# EAGLE design tas5753 (EAGLE 6.6.0)
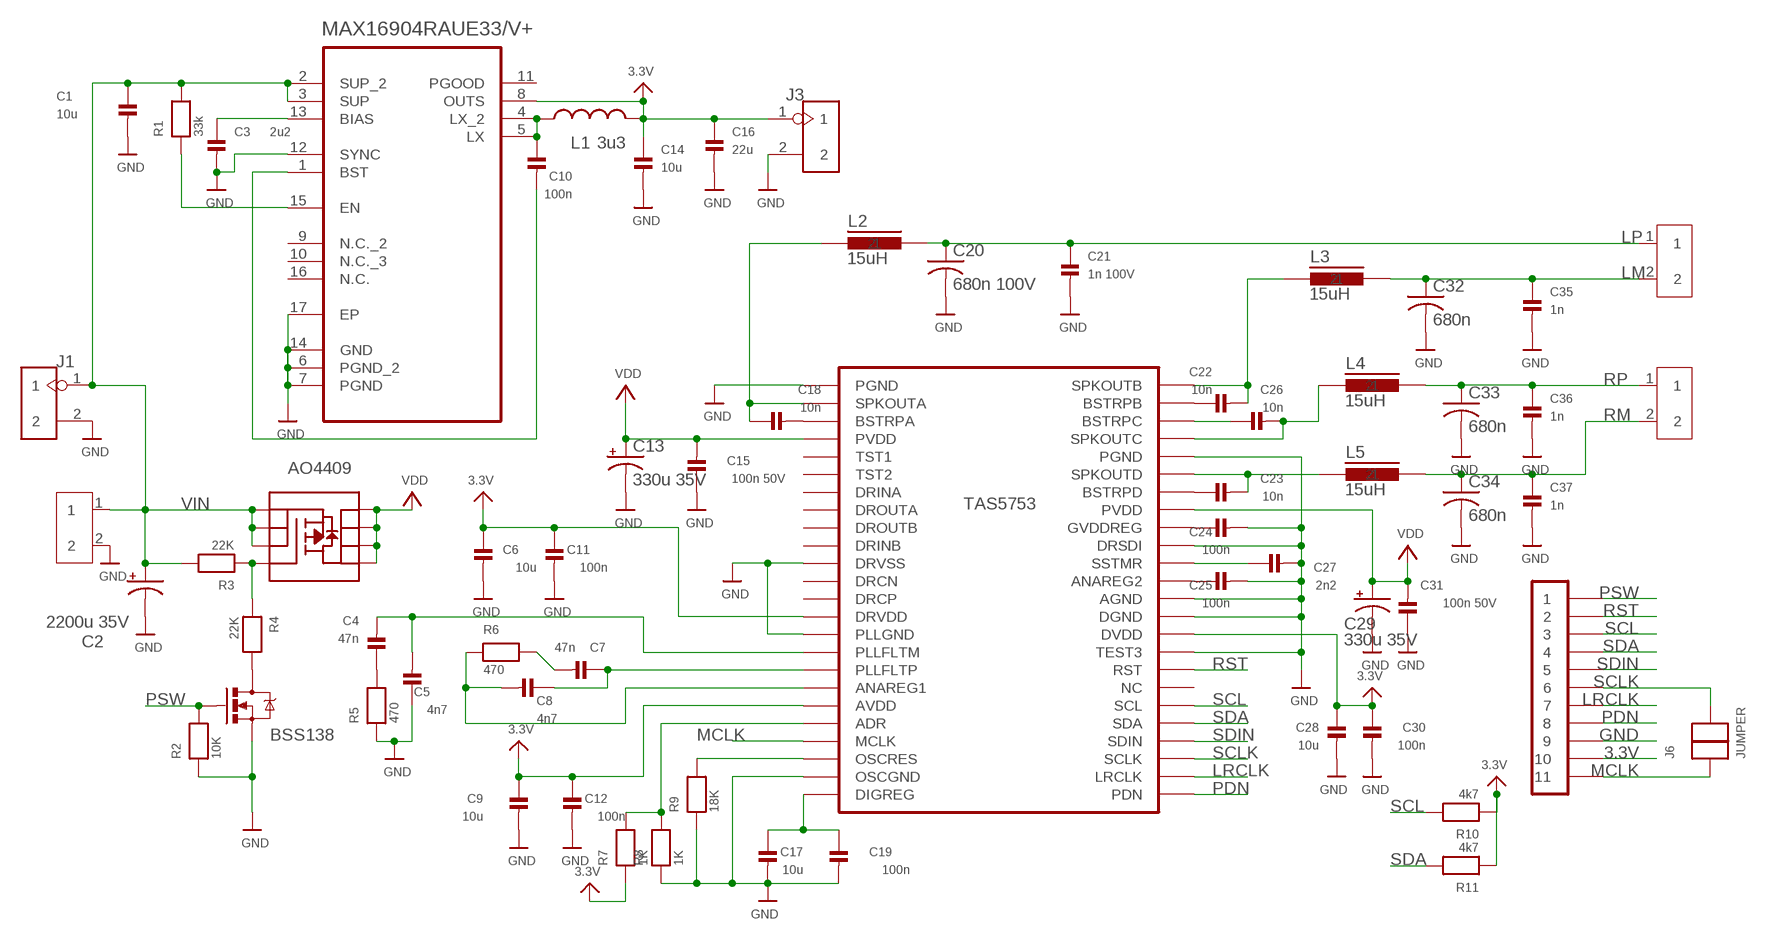
[diagram p0: schematic, sheet 1]

## Parts
C1  10u  CAP_CERAMIC0805  [0805]
C2  2200u 35V  CAP_POLPTH4  [CPOL-RADIAL-1000UF-25V]
C3  2u2  CAP_CERAMIC0805  [0805]
C4  47n  CAP_CERAMIC0603  [0603]
C5  4n7  CAP_CERAMIC0603  [0603]
C6  10u  CAP_CERAMIC0603  [0603]
C7  47n  CAP_CERAMIC0603  [0603]
C8  4n7  CAP_CERAMIC0603  [0603]
C9  10u  CAP_CERAMIC0603  [0603]
C10  100n  CAP_CERAMIC0603  [0603]
C11  100n  CAP_CERAMIC0603  [0603]
C12  100n  CAP_CERAMIC0603  [0603]
C13  330u 35V  CAP_POLE  [PANASONIC_E]
C14  10u  CAP_CERAMIC0805  [0805]
C15  100n 50V  CAP_CERAMIC0603  [0603]
C16  22u  CAP_CERAMIC1206  [1206]
C17  10u  CAP_CERAMIC0603  [0603]
C18  10n  CAP_CERAMIC0603  [0603]
C19  100n  CAP_CERAMIC0603  [0603]
C20  680n 100V  C-US050-045X075  [C050-045X075]
C21  1n 100V  CAP_CERAMIC1206  [1206]
C22  10n  CAP_CERAMIC0603  [0603]
C23  10n  CAP_CERAMIC0603  [0603]
C24  100n  CAP_CERAMIC0603  [0603]
C25  100n  CAP_CERAMIC0603  [0603]
C26  10n  CAP_CERAMIC0603  [0603]
C27  2n2  CAP_CERAMIC0603  [0603]
C28  10u  CAP_CERAMIC0603  [0603]
C29  330u 35V  CAP_POLE  [PANASONIC_E]
C30  100n  CAP_CERAMIC0603  [0603]
C31  100n 50V  CAP_CERAMIC0603  [0603]
C32  680n  C-US050-045X075  [C050-045X075]
C33  680n  C-US050-045X075  [C050-045X075]
C34  680n  C-US050-045X075  [C050-045X075]
C35  1n  CAP_CERAMIC1206  [1206]
C36  1n  CAP_CERAMIC1206  [1206]
C37  1n  CAP_CERAMIC1206  [1206]
IC1  AO4409  MOSFET-PCHANNEL-SOIC8SOIC8  [SO08]
J1  HEADER-2P-2.0  [2P-2.0]
J2  SCREW-TERMINAL-2P'5.08'  [2P-5.08]
J3  HEADER-2P-2.0  [2P-2.0]
J4  SCREW-TERMINAL-2P'5.08'  [2P-5.08]
J5  SCREW-TERMINAL-2P'5.08'  [2P-5.08]
J6  JUMPER  [JUMPER]
L1  3u3  INDUCTORCR54  [CR54]
L2  15uH  DR125  [DR125]
L3  15uH  DR125  [DR125]
L4  15uH  DR125  [DR125]
L5  15uH  DR125  [DR125]
P1  CONN_1X11_SMT_254  [CONN_SMT_1X11_254]
Q1  BSS138  MOSFET-NCHANNELBSS138  [SOT23]
R1  33k  RESISTOR0603  [0603]
R2  10K  RESISTOR0603  [0603]
R3  22K  RESISTOR0603  [0603]
R4  22K  RESISTOR0603  [0603]
R5  470  RESISTOR0603  [0603]
R6  470  RESISTOR0603  [0603]
R7  1K  RESISTOR0603  [0603]
R8  1K  RESISTOR0603  [0603]
R9  18K  RESISTOR0603  [0603]
R10  4k7  RESISTOR0603  [0603]
R11  4k7  RESISTOR0603  [0603]
U1  MAX16904RAUE33/V+  [SOP65P638X110-17N]
U2  TAS5753  [HTSSOP_48]

## Nets
3.3V: C6.1 C9.1 C11.1 C12.1 C14.1 C16.1 C28.1 C30.1 J3.1 L1.P$2 P1.P$10 R7.1 R10.1 R11.1 U1.8(OUTS) U2.P$14(DRVDD) U2.P$19(AVDD) U2.P$34(DVDD)
GND: C1.2 C2.2(-) C3.2 C5.1 C6.2 C9.2 C11.2 C12.2 C13.- C14.2 C15.1 C16.2 C17.2 C19.2 C20.2 C21.2 C24.2 C25.2 C27.2 C28.2 C29.- C30.2 C31.1 C32.2 C33.2 C34.2 C35.2 C36.2 C37.2 J1.2 J2.2 J3.2 P1.P$9 Q1.2(S) R2.1 R5.1 R8.1 R9.1 U1.6(PGND_2) U1.7(PGND) U1.12(SYNC) U1.14(GND) U1.17(EP) U2.P$1(PGND) U2.P$11(DRVSS) U2.P$15(PLLGND) U2.P$23(OSCGND) U2.P$33(TEST3) U2.P$35(DGND) U2.P$36(AGND) U2.P$39(DRSDI) U2.P$44(PGND) U2.P$49(PGND)
LM: C32.1 C35.1 J4.2 L3.2
LP: C20.1 C21.1 J4.1 L2.2
LRCLK: P1.P$7 U2.P$26(LRCLK)
MCLK: J6.1 P1.P$11 U2.P$21(MCLK)
N$1: R9.2 U2.P$22(OSCRES)
N$2: C7.2 R6.2
N$3: C18.2 U2.P$3(BSTRPA)
N$4: C7.1 C8.1 U2.P$17(PLLFLTP)
N$5: C26.1 U2.P$46(BSTRPC)
N$6: C22.1 U2.P$47(BSTRPB)
N$7: C22.2 L3.1 U2.P$48(SPKOUTB)
N$8: C26.2 L4.1 U2.P$45(SPKOUTC)
N$9: R7.2 R8.2 U2.P$20(ADR)
N$10: C4.1 R5.2
N$11: C18.1 L2.1 U2.P$2(SPKOUTA)
N$12: C4.2 C5.2 U2.P$16(PLLFLTM)
N$13: C23.1 U2.P$42(BSTRPD)
N$14: C23.2 L5.1 U2.P$43(SPKOUTD)
N$15: C27.1 U2.P$38(SSTMR)
N$16: C25.1 U2.P$37(ANAREG2)
N$17: IC1.4(G) R3.1 R4.1
N$18: C24.1 U2.P$40(GVDDREG)
N$20: C10.1 L1.P$1 U1.4(LX_2) U1.5(LX)
N$22: C10.2 U1.1(BST)
N$23: C8.2 R6.1 U2.P$18(ANAREG1)
N$24: C3.1 U1.13(BIAS)
N$25: R1.1 U1.15(EN)
N$27: C17.1 C19.1 U2.P$24(DIGREG)
N$28: Q1.3(D) R4.2
PDN: P1.P$8 U2.P$25(PDN)
PSW: P1.P$1 Q1.1(G) R2.2
RM: C34.1 C37.1 J5.2 L5.2
RP: C33.1 C36.1 J5.1 L4.2
RST: P1.P$2 U2.P$32(RST)
SCL: P1.P$3 R10.2 U2.P$30(SCL)
SCLK: J6.2 P1.P$6 U2.P$27(SCLK)
SDA: P1.P$4 R11.2 U2.P$29(SDA)
SDIN: P1.P$5 U2.P$28(SDIN)
VDD: C13.+ C15.2 C29.+ C31.2 IC1.5(D) IC1.6(D) IC1.7(D) IC1.8(D) U2.P$4(PVDD) U2.P$41(PVDD)
VIN: C1.1 C2.1(+) IC1.1(S) IC1.2(S) IC1.3(S) J1.1 J2.1 R1.2 R3.2 U1.2(SUP_2) U1.3(SUP)
Unconnected: U1.9(N.C._2) U1.10(N.C._3) U1.11(PGOOD) U1.16(N.C.) U2.P$5(TST1) U2.P$6(TST2) U2.P$7(DRINA) U2.P$8(DROUTA) U2.P$9(DROUTB) U2.P$10(DRINB) U2.P$12(DRCN) U2.P$13(DRCP) U2.P$31(NC)

## Library data of the parts
C1 C3-C12 C14-C19 C21-C28 C30 C31 C35-C37 = hari:CAP_CERAMIC: Ceramic Capacitors 0402 - 0402 Surface Mount Capacitors 0.1uF 10V 10% [Digikey: 490-1318-2-ND] 0603 - 0603 Surface Mount Capacitors 16 pF 50V 5% [Digikey: 445-5051-2-ND] 22 pF 50V [Digikey: PCC220ACVTR-ND] 33 pF 50V 5% [Digikey: 490-1415-1-ND] 56pF 50V 5% [Digikey: 490-1421-1-ND] 220pF 50V 5% [Digikey: 445-1285-1-ND] 680 pF 50V 2200 pF 50V 5% C0G [Digikey: 445-1297-1-ND] 5600 pF 100V 5% X7R [Digikey: 478-3711-1-ND] 0.1 µF 25V 10% [Digikey: PCC2277TR-ND] 0.22 µF 16V 10% X7R [Digikey: 445-1318-1-ND] 1.0 µF 25V 10% [Digikey: 445-5146-2-ND] 0603 - RF Specific 3pF 250V +/-0.1pF RF [Digikey: 712-1347-1-ND] 18 pF 250V 5% [Digikey: 478-3505-1-ND or 712-1322-1-ND] 56 pF 250V 5% C0G RF [Digikey: 490-4867-1-ND] 68 pF 250V RF [Digikey: 490-4868-1-ND] 0805 - 0805 Surface Mount Capacitors 220 pF 250V 2% RF Ceramic Capacitor [Digikey: 712-1398-1-ND] 1000 pF 50V 2% NP0 Ceramic Capacitor [Digikey: 478-3760-1-ND] 0.1 µF 25V 10% Ceramic Capacitor [Digikey: PCC1828TR-ND] 1.0 µF 16V 10% Ceramic Capacitor[Digikey: 490-1691-2-ND] 10.0 µF 10V 10% Ceramic Capacitor[Digikey: 709-1228-1-ND] 1206 - 1206 Surface Mount Capacitors
C2 C13 C29 = SparkFun-Passives:CAP_POL: Capacitor Polarized These are standard SMD and PTH capacitors. Normally 10uF, 47uF, and 100uF in electrolytic and tantalum varieties. Always verify the external diameter of the through hole cap, it varies with capacity, voltage, and manufacturer. The EIA devices should be standard.
C20 C32-C34 = adafruit:C-US: CAPACITOR, American symbol
IC1 = SparkFun-DiscreteSemi:MOSFET-PCHANNEL-SOIC8: Generic 8-pin PMOSFET
J1 J3 = Connector :HEADER-2P
J2 J4 J5 = Connector :SCREW-TERMINAL-2P
J6 = hari:JUMPER
L1 = SparkFun-Passives:INDUCTOR: Inductors Basic Inductor/Choke - 0603 and 1206. Footprints are not proven and vary greatly between part numbers. SRN6045- 33uH, 20% 1.4A SDR0403-560KL - 56uH, 10%, 500mA RMS/740mA peak
L2-L5 = inductors:DR125: High Power Density, High Efficiency, Shielded Inductors Source: coiltronics_dr_series.pdf
P1 = hari:CONN_1X11_SMT_254
Q1 = SparkFun-DiscreteSemi:MOSFET-NCHANNEL: Common NMOSFET Parts MFG P/N Store ID Prod ID FDD8780 TRANS-09984 SI7820DN TRANS-11055 FDS6630A IC-08089 2N7002PW TRANS-11151 FQP30N06L COM-10213 TRANS-10060 BSS123LT1G TRANS-08345 BSS138 TRANS-00830 BS170 2N7000; PROD_ID: TRANS-00830
R1-R11 = hari:RESISTOR: Resistors 0402 - 0402 Surface Mount Package 10.0K 1% 1/16W [Digikey: 311-10.0KLRTR-ND] 0603 - 0603 Surface Mount Package 0 Ohm 1/10 Watt 1% Resistor 15 Ohm 1/10 Watt 1% Resistor 33 Ohm 1/10 Watt 1% Resistor 49.9 Ohm 1/10 Watt 1% Resistor 100 Ohm 1/10 Watt 1% Resistor 150 Ohm 1/10 Watt 1% Resistor 240 Ohm 1/10 Watt 1% Resistor 390 Ohm 1/10 Watt 1% Resistor 560 Ohm 1/10 Watt 1% Resistor 750 Ohm 1/10 Watt 1% Resistor 1.0K Ohm 1/10 Watt 1% Resistor 1.5K Ohm 1/10 Watt 1% Resistor 2.0K Ohm 1/10 Watt 1% Resistor 4.7K Ohm 1/10 Watt 1% Resistor 10.0K Ohm 1/10 Watt 1% Resistor 20.0K Ohm 1/10 Watt 1% Resistor 33.0K Ohm 1/10 Watt 1% Resistor 100.0K Ohm 1/10 Watt 1% Resistor 0805 - 0805 Surface Mount Package 0 Ohm 1/8 Watt 1% Resistor 33 Ohm 1/8 Watt 1% Resistor 100 Ohm 1/8 Watt 1% Resistor 150 Ohm 1/8 Watt 1% Resistor 200 Ohm 1/8 Watt 1% Resistor 240 Ohm 1/8 Watt 1% Resistor 330 Ohm 1/8 Watt 1% Resistor 390 Ohm 1/8 Watt 1% Resistor 470 Ohm 1/8 Watt 1% Resistor 1.0K Ohm 1/8 Watt 1% Resistor 1.5K Ohm 1/8 Watt 1% Resistor 2.0K Ohm 1/8 Watt 1% Resistor 4.7K Ohm 1/8 Watt 1% Resistor 5.1K Ohm 1/8 Watt 1% Resistor 5.6K Ohm 1/8 Watt 1% Resistor 10.0K Ohm 1/8 Watt 1% Resistor 22.0K Ohm 1/8 Watt 1% Resistor 33.0K Ohm 1/8 Watt 1% Resistor 100K Ohm 1/8 Watt 1% Resistor 1206 - 1206 Surface Mount Package
U1 = Maxim_By_element14_Batch_1:MAX16904RAUE33/V+: 2.1MHz, High-Voltage, 600mA Mini-Buck Converter; MPN: MAX16904RAUE33/V+; OC_FARNELL: -; OC_NEWARK: 71R9172; PACKAGE: TSSOP-16; SUPPLIER: Maxim
U2 = hari:TAS5753

## Board
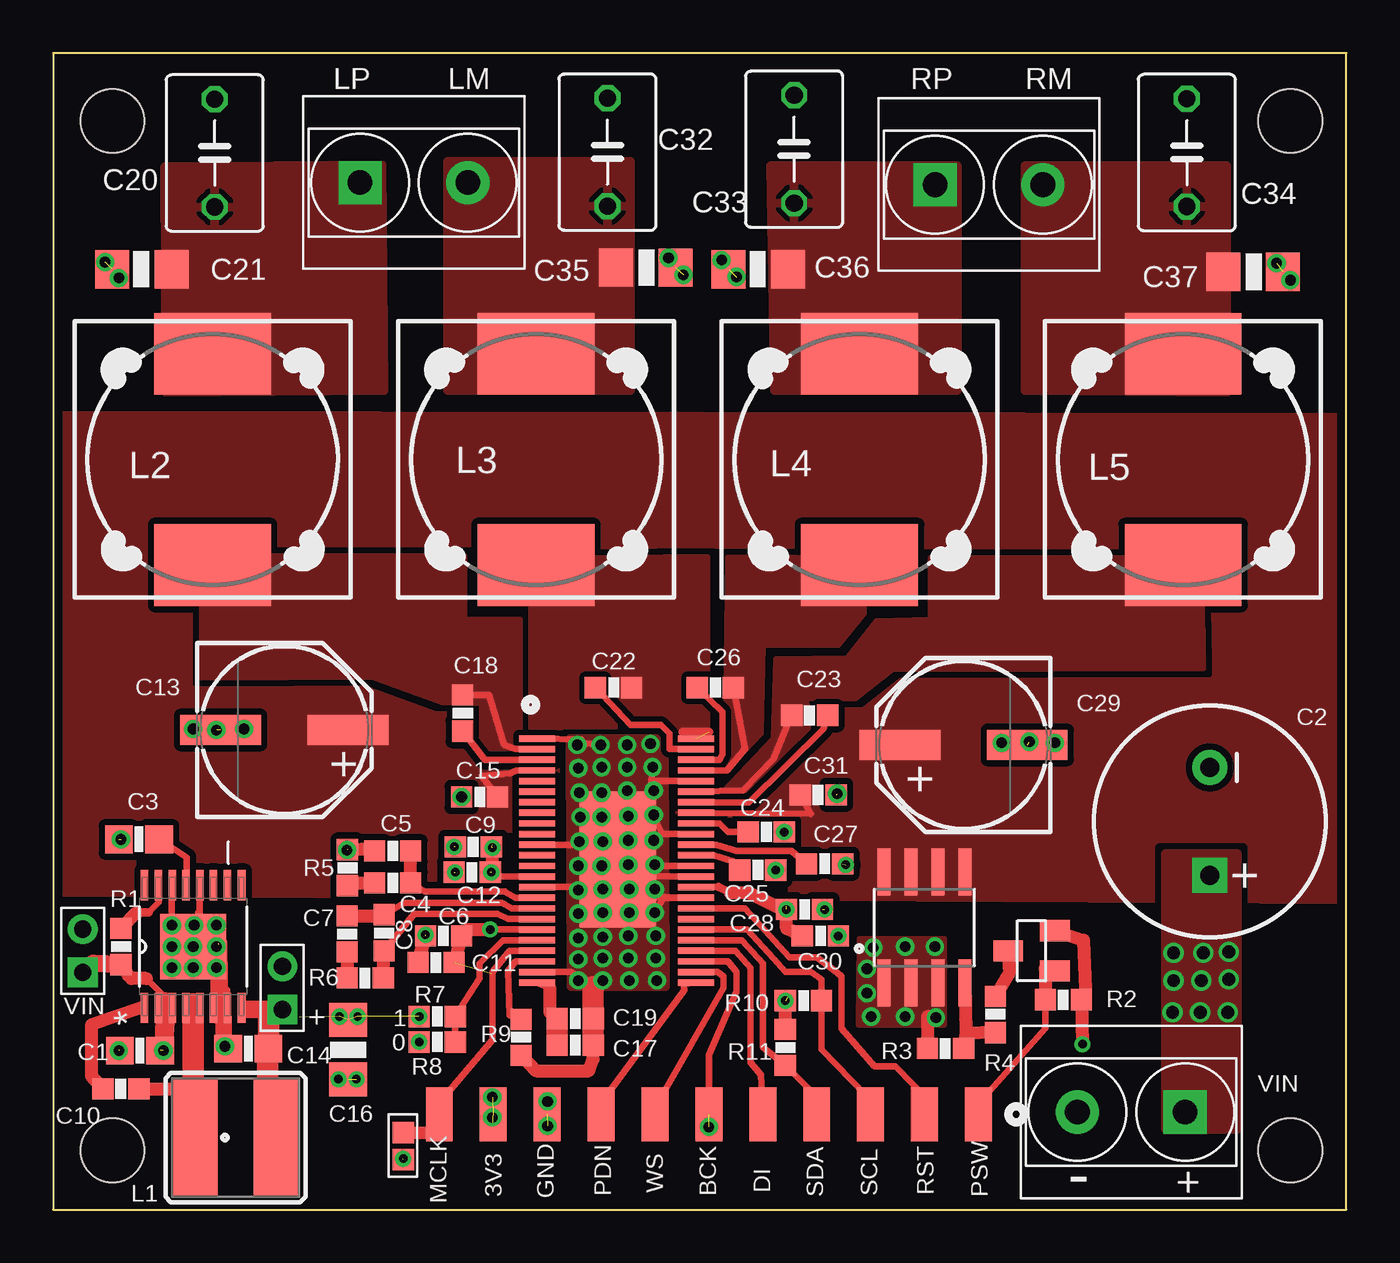
[diagram p1: board, top side]
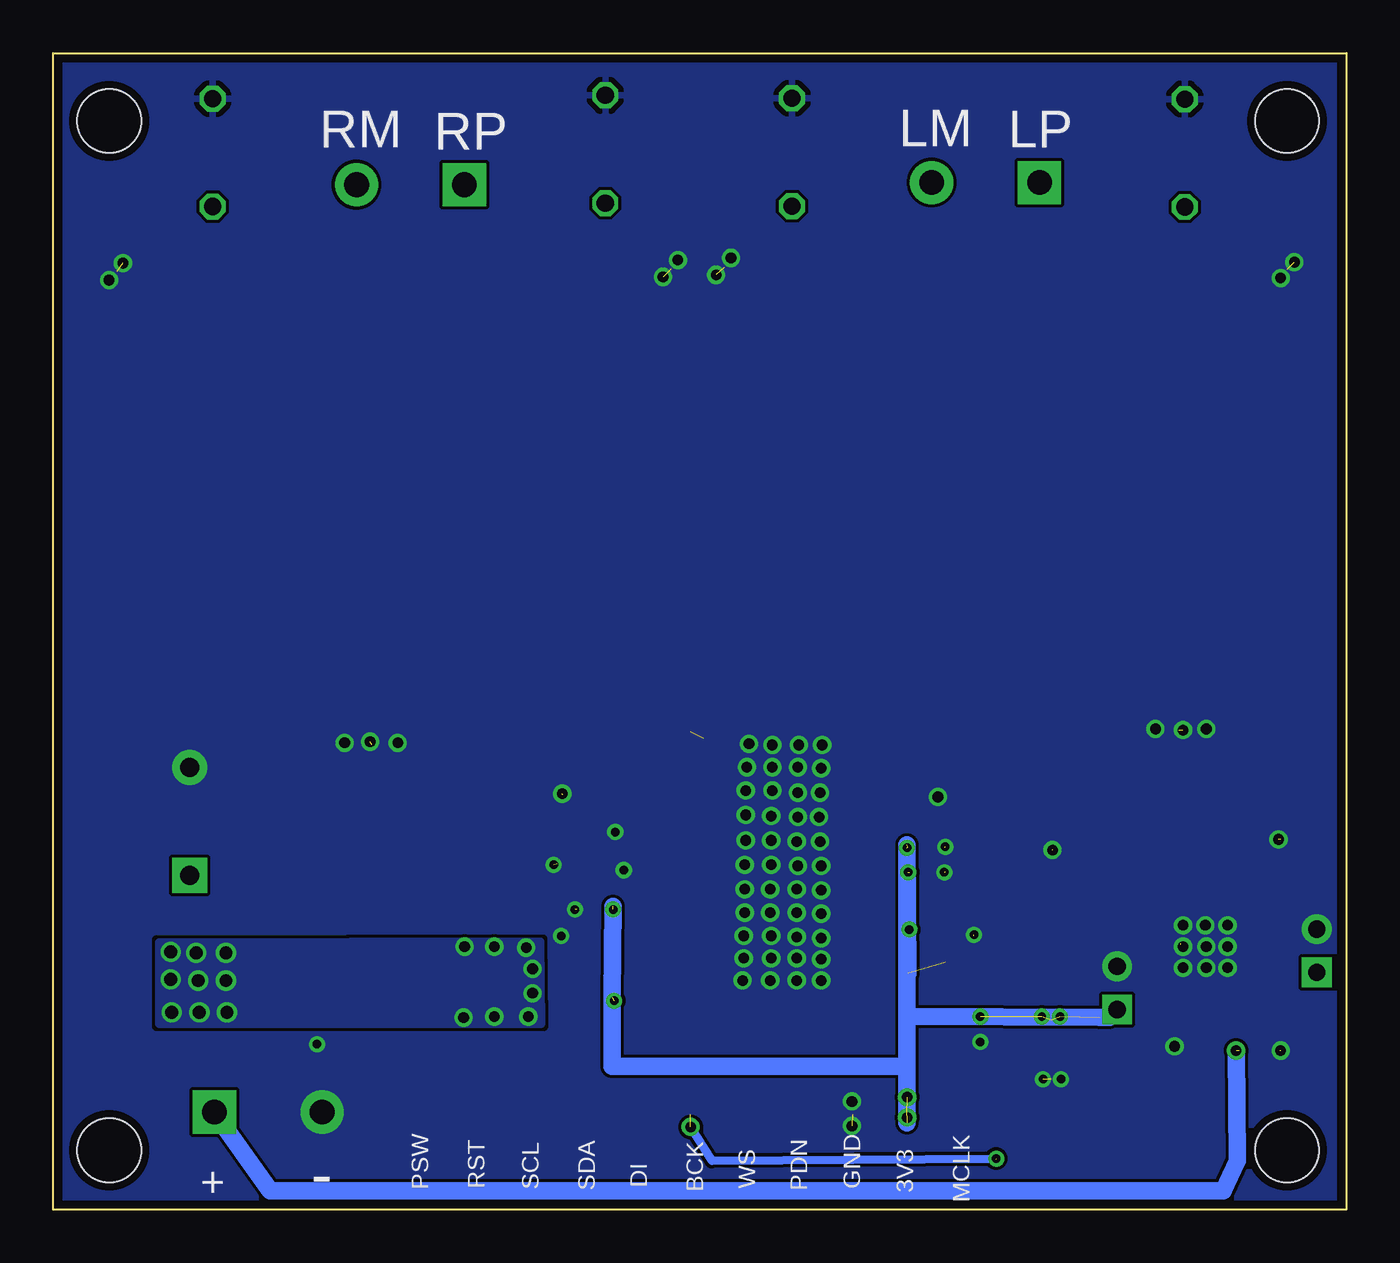
[diagram p2: board, bottom side, seen from below]

Size 60.94 x 54.5 mm. Coordinates in mm from the lower left corner, seen from the top.
Outline: 0,0 60.94,0 60.94,54.5 0,54.5 0,0
Copper layers (1*16): Top 0.0356mm / dielectric 1.5011mm / Bottom 0.0356mm
Design rules "oshpark-2layer": minimum track width 6mil, minimum drill 13mil, track to track 6mil, track to pad 6mil, pad to pad 6mil, via to via 6mil, smd to smd 6mil, copper to edge 15mil, drill to drill 6mil, minimum pad ring 7mil, minimum via ring 7mil, stop-mask expansion 4mil, vias tented up to drill 0mil, thermal gap 10mil
Holes 3 mm at 58.3,2.8 58.3,51.3 2.8,51.3 2.8,2.8

### Footprints (pad centres in the part's own frame; a part is rotated, then mirrored left to right if it is on the bottom)
0805 = smd 1.3 x 1.3: 1 -0.95,0; 2 0.95,0
CPOL-RADIAL-1000UF-25V = drill 0.9 pad 1.651 square: 1 2.54,0 | drill 0.9 pad 1.651: 2 -2.54,0
0603 = smd 1 x 1: 1 -0.85,0; 2 0.85,0
PANASONIC_E = smd 3.8 x 1.4: + 3,0; - -3,0
1206 = smd 1.6 x 1.8: 1 -1.4,0; 2 1.4,0
C050-045X075 = drill 0.813 octagon: 1 -2.54,0; 2 2.54,0
SO08 = smd 0.61 x 2.21: 1 -1.905,-2.616; 2 -0.635,-2.616; 3 0.635,-2.616; 4 1.905,-2.616; 5 1.905,2.616; 6 0.635,2.616; 7 -0.635,2.616; 8 -1.905,2.616
2P-2.0 = drill 0.813 pad 1.397 square: 1 -1.016,0 | drill 0.813 pad 1.397: 2 1.016,0
2P-5.08 = drill 1.168 pad 2.032 square: 1 0,2.54 | drill 1.168 pad 2.032: 2 0,-2.54
JUMPER = smd 1 x 1: 1 -0.635,0; 2 0.635,0
CR54 = smd 5.5 x 2.15: P$1 0,1.92; P$2 0,-1.92
DR125 = smd 3.85 x 5.5: 1 -4.975,0; 2 4.975,0
CONN_SMT_1X11_254 = smd 2.54 x 1.27: P$1 0,0; P$2 0,-2.54; P$3 0,-5.08; P$4 0,-7.62; P$5 0,-10.16; P$6 0,-12.7; P$7 0,-15.24; P$8 0,-17.78; P$9 0,-20.32; P$10 0,-22.86; P$11 0,-25.4
SOT23 = smd 1 x 1.4: 1 -0.95,-1.1; 2 0.95,-1.1; 3 0,1.1
SOP65P638X110-17N = smd 1.422 x 0.356: 1 -2.896,2.286; 2 -2.896,1.626; 3 -2.896,0.965; 4 -2.896,0.33; 5 -2.896,-0.33; 6 -2.896,-0.965; 7 -2.896,-1.626; 8 -2.896,-2.286; 9 2.896,-2.286; 10 2.896,-1.626; 11 2.896,-0.965; 12 2.896,-0.33; 13 2.896,0.33; 14 2.896,0.965; 15 2.896,1.626; 16 2.896,2.286 | smd 3.099 x 3.099: 17 0,0
HTSSOP_48 = smd 1.7 x 0.3: P$1 0,0; P$2 0,-0.5; P$3 0,-1; P$4 0,-1.5; P$5 0,-2; P$6 0,-2.5; P$7 0,-3; P$8 0,-3.5; P$9 0,-4; P$10 0,-4.5; P$11 0,-5; P$12 0,-5.5; P$13 0,-6; P$14 0,-6.5; P$15 0,-7; P$16 0,-7.5; P$17 0,-8; P$18 0,-8.5; P$19 0,-9; P$20 0,-9.5; P$21 0,-10; P$22 0,-10.5; P$23 0,-11; P$24 0,-11.5; P$25 7.5,-11.5; P$26 7.5,-11; P$27 7.5,-10.5; P$28 7.5,-10; P$29 7.5,-9.5; P$30 7.5,-9; P$31 7.5,-8.5; P$32 7.5,-8; P$33 7.5,-7.5; P$34 7.5,-7; P$35 7.5,-6.5; P$36 7.5,-6; P$37 7.5,-5.5; P$38 7.5,-5; P$39 7.5,-4.5; P$40 7.5,-4; P$41 7.5,-3.5; P$42 7.5,-3; P$43 7.5,-2.5; P$44 7.5,-2; P$45 7.5,-1.5; P$46 7.5,-1; P$47 7.5,-0.5; P$48 7.5,0 | smd 3.6 x 6.4: P$49 3.8,-5.7

### Placement (x,y rotation side)
C1  4.1,7.5 180 top
C2  54.5,18.3 270 top
C3  4.05,17.45 180 top
C4  16,15.4 0 top
C5  16,16.9 0 top
C6  18.4,12.9 180 top
C7  13.85,13 270 top
C8  15.6,13.05 270 top
C9  19.8,17.1 180 top
C10  3.2,5.7 180 top
C11  18.05,11.65 180 top
C12  19.75,15.9 180 top
C13  10.9,22.6 0 top
C14  9.2,7.6 180 top
C15  20.1,19.45 0 top
C16  13.9,7.55 270 top
C17  24.6,7.75 0 top
C18  19.3,23.4 270 top
C19  24.6,9 0 top
C20  7.62,49.79 90 top
C21  4.18,44.31 180 top
C22  26.4,24.6 0 top
C23  35.65,23.3 180 top
C24  33.6,17.8 0 top
C25  33.2,16 0 top
C26  31.2,24.6 0 top
C27  36.35,16.3 0 top
C28  35.4,14.15 0 top
C29  42.9,21.9 180 top
C30  36.15,12.9 0 top
C31  36.05,19.55 180 top
C32  26.12,49.83 90 top
C33  34.92,49.97 90 top
C34  53.42,49.81 90 top
C35  27.93,44.39 0 top
C36  33.23,44.31 180 top
C37  56.54,44.19 0 top
IC1  41.05,13.3 0 top
J1  1.4,12.2 90 top
J2  50.8,4.6 270 top
J3  10.8,10.45 90 top
J4  17,48.4 90 top
J5  44.1,48.3 90 top
J6  16.5,3 270 top
L1  8.6,3.4 90 top
L2  7.52,35.35 90 top
L3  22.76,35.35 90 top
L4  38,35.35 90 top
L5  53.24,35.35 90 top
P1  43.6,4.5 270 top
Q1  46.1,12.2 90 top
R1  3.2,12.4 270 top
R2  47.6,9.9 180 top
R3  42.05,7.6 180 top
R4  44.4,9.2 90 top
R5  13.87,16.12 270 top
R6  14.71,10.92 180 top
R7  18.1,9.1 0 top
R8  18.1,7.9 0 top
R9  22.05,8.12 90 top
R10  35.35,9.85 0 top
R11  34.5,7.65 270 top
U1  6.6,12.4 90 top
U2  22.8,22.2 0 top

### Tracks (layer width: path | path; a pad name or v marks a point on that pad's centre or on a via)
3.3V  (via drill 0.4, 0.5)  (13 unrouted)
  Top 0.305: 19.55,13.2 C6.1 19.2,12.7 | v20.6,13.2 U2.P$19 | U2.P$14 21.05,15.7 C12.1 20.7,15.85 | R11.1 34.65,8.75 34.5,8.3 | U2.P$34 31.35,15.2 | 9.8,9.4 9.69,9.45 U1.8 | J3.1 10.85,9.6 10.15,9.3
  Top 0.406: 31.35,15.2 31.9,14.95
  Top 0.61: 10.15,7.65 C14.1 | 19.55,13.2 v20.6,13.2 | C11.1 19.2,12.7 | 20.7,15.85 v20.7,17.05 | 34.5,8.3 R10.1 | 31.9,14.95 32.75,14.95 34.25,14.19 C28.1 34.56,13.24 C30.1 | 10.7,9.45 10.42,9.07
  Top 0.813: J3.1 9.8,9.4 10.15,9.3 10.7,9.45 9.15,9.45
  Top 1.016: C14.1 10.1,7.5 10.1,4.2 L1.P$2 | 10.15,9.3 10.15,7.65
  Bottom 0.813: 20.7,6.75 20.7,9.1 | 20.7,11.1 20.7,16.87 20.72,17.2 20.67,11.13 20.7,11.1 | 20.7,11.1 20.7,9.1 | 20.7,9.1 11.62,9.07 11.16,9.07 J3.1 | 20.7,4.1 20.7,6.75 | 20.7,6.75 34.6,6.75 34.6,10 34.55,14.29
  other vias: 20.7,5.3 34.5,9.85 34.55,14.15 20.65,15.9 17.25,9.1 13.5,9.1 14.35,9.1 20.7,4.35
GND  (via drill 0.4, 0.5)  (18 unrouted)
  Top 0.254: 6.83,13.46 7.8,12.5
  Top 0.305: 8.1,9.1 U1.7 8.2,9.5 8.2,10.35 | C19.2 25.45,9.5 | U2.P$23 24.4,11.2 25.48,10.58 | U2.P$15 24.5,15.2 v24.75,15.05 | 17.2,11.85 C11.2 | U2.P$11 24.85,17.2 v24.8,17.35 | v28.35,14 28.8,14.75 U2.P$33 28.55,14.7 26.4,15.25 | 28.35,15.7 v27.15,15.1 | U2.P$39 28.7,17.7 v28.3,18.6 | U2.P$35 28.35,15.7 | 28.35,15.7 28.3,16.2 U2.P$36 | U2.P$1 24.9,22.15 24.9,22 v25.8,21.9 | U2.P$44 28.2,20.2 v28.25,20.85 | U1.14 5.6,15.3 v5.6,12.4 | U1.12 6.9,15.3 6.9,14 6.83,14 6.83,13.46 | v7.7,12.4 6.55,12.4 6.55,12.45 7.8,12.55 | 8.2,10.35 7.85,9.1 | 7.85,9.1 7.57,10.35 | 8.2,10.35 7.57,10.35 | 7.57,10.35 U1.6 | 7.85,9.1 7.8,9.1 7.8,8.15 8.25,8.15 C14.2 | R9.1 22.08,7.27
  Top 0.61: 8.1,9.1 v8.1,7.7 | 25.45,10.5 25.48,10.58 v24.75,10.8 | C11.2 C6.2 | R5.1 14.55,17 C5.1 | Q1.2 48.55,12.7 48.65,10.4 R2.1 v48.5,7.8 | 22.08,7.27 22.75,6.55 25.25,6.55 25.45,7.1 C17.2
  Top 0.813: 7.8,12.55 7.85,9.1
  Top 1.016: C17.2 C19.2 | 25.45,9.5 25.45,10.5
  other vias: 27.05,19.75 13.85,16.95 9,22.65 6.6,22.65 44.7,22 46,22.05 47.2,22 36.35,14.15 37,12.9 17.55,12.95 18.9,17.1 18.95,15.9 34.05,16 37.35,16.25 34.45,17.8 2.45,44.65 36.95,19.6 19.25,19.45 27.1,17.4 25.9,17.35 24.75,16.2 28.4,12.9 25.9,14 27.1,12.9 24.75,12.8 27.1,11.85 25.9,10.8 27.15,10.8 25.9,11.85 28.45,10.8 28.4,11.85 27.15,14 28.35,15.1 28.3,17.4 27.1,18.55 25.85,18.5 27.1,16.25 25.85,16.2 25.9,15.1 24.75,13.95 24.75,11.8 25.9,12.85 24.85,18.5 27.05,20.85 28.3,19.75 24.8,19.65 25.85,19.65 24.75,20.8 27.05,21.9 28.15,21.95 7.7,22.6 5.6,13.4 7.7,13.4 5.6,11.4 7.7,11.4 6.6,11.4 6.6,12.4 3.1,7.5 3.2,17.45 17.25,7.9 24.7,21.9 25.85,20.85 28.35,16.25 23.3,5.1 3.1,43.9 29,44.85 29.7,44.05 31.5,44.75 32.2,43.95 57.65,44.6 58.3,43.8 13.45,6.15 14.3,6.15 6.65,13.4 23.3,3.95
  pour Top (isolate 0.254): 24.35,22.2 28.8,22.2 28.85,10.5 24.4,10.5
  pour Bottom (rank 2): 0,0 61,0 61,54.2 0,54.2
LM
  pour Top (isolate 0.305): 18.6,49.4 27.2,49.4 27.2,38.6 18.6,38.6
LP
  pour Top (isolate 0.305): 15.5,49.25 15.6,38.6 5.3,38.5 5.25,49.15
LRCLK
  Top 0.305: U2.P$26 31.3,11.2 31.6,11 31.6,10.45 28.65,5.3 P1.P$7
MCLK
  Top 0.305: U2.P$21 21.5,12.2 20.7,11.2 20.7,8 18.5,5.4 P1.P$11
  Top 0.406: 18.1,3.9 18.1,4 P1.P$11
  Top 0.61: J6.1 17.85,3.65 17.7,3.6 18.1,3.9
N$1
  Top 0.305: U2.P$22 21.8,11.7 21.45,11.25 21.5,9.15 R9.2
N$2
  Top 0.61: C7.2 R6.2
N$3
  Top 0.305: U2.P$3 20.35,21.2 C18.2
N$4
  Top 0.305: U2.P$17 21.6,14.2 21.25,14.4 21.15,14.45 16.55,14.45 C8.1
  Top 0.61: C7.1 15.6,13.85 C8.1
N$5
  Top 0.305: U2.P$46 31.4,21.2 31.55,21.45 31.55,23.45 C26.1
N$6
  Top 0.305: U2.P$47 29.05,21.7 29.05,22.45 28.65,22.85 27.2,22.85 C22.1
N$7  (1 unrouted)
  Top 0.406: 29.65,22.5 30.9,22.5
  Top 3.81: L3.1 22.02,30.38 22,30.4
  pour Top (isolate 0.254, rank 2): 22.55,30.65 30.8,30.75 30.8,22.25 22.55,22.15
N$8
  Top 0.305: U2.P$45 31.75,20.7 32.6,21.7 C26.2
  pour Top (isolate 0.254): 31.8,30.75 38.25,30.7 38.25,29.45 38.2,28.2 38.25,28.15 37,26.6 33.45,26.6 33.35,22.45 31.65,20.65
N$9
  Top 0.305: U2.P$20 21.2,12.7 20.1,11.6 20.1,10.9 R7.2 R8.2
N$10
  Top 0.305: R5.2 14.1,15.4
  Top 0.61: 14.1,15.4 C4.1
N$11
  Top 0.305: U2.P$2 21.8,21.7 21.25,21.9 20.55,24.25 C18.1
  pour Top (isolate 0.254): 7,30.8 19.4,30.8 19.4,27.8 22,27.8 22,21.65 20.2,21.7 20.2,23.85 18.35,23.9 15.05,25.1 7,25.05
N$12
  Top 0.305: U2.P$16 21.8,14.7 21.35,14.95 21.3,15 17.5,15 C4.2
  Top 0.61: C4.2 C5.2
N$13
  Top 0.305: U2.P$42 32.8,19.2 36.3,22.65 C23.1
N$14
  Top 0.305: U2.P$43 32.5,19.75 33.95,21.25 C23.2
  pour Top (isolate 0.254): 41.35,30.7 41.35,27.8 38.8,27.75 37.45,26.05 37.45,26 34.05,25.95 33.95,22.2 31.6,19.7 33.15,19.75 35.6,22.2 35.5,24.1 37.8,24.1 39.55,25.45 54.2,25.5 54.1,30.7
N$15
  Top 0.305: U2.P$38 31.25,17.2 32.2,16.9 34.8,16.9 C27.1
N$16
  Top 0.305: U2.P$37 31.15,16.7 32.05,16.4 C25.1
N$17
  Top 0.61: IC1.4 43.01,8.31 | 43.01,8.31 R3.1 | R4.1 43.01,8.31
N$18
  Top 0.305: U2.P$40 31.4,18.2 31.8,17.8 C24.1
N$20
  Top 0.305: U1.4 6.3,8.6 6.6,9.7 6.9,8.6 U1.5
  Top 0.61: C10.1 6.2,5.7 6.46,4.47 L1.P$1
  Top 0.813: 6.6,6 6.46,4.47
  Top 1.016: 6.6,9.7 6.6,6
N$22
  Top 0.305: U1.1 4.15,9.5
  Top 0.61: 4.15,9.5 1.8,8.7 1.8,6.3 C10.2
N$23
  Top 0.305: U2.P$18 21.45,13.7 20.95,13.95 17,13.95 C8.2
  Top 0.61: C8.2 15.56,12.2 R6.1
N$24
  Top 0.305: U1.13 6.3,16.6 C3.1
N$25
  Top 0.305: U1.15 4.97,14.47 4.5,14
  Top 0.406: 4.5,14 3.95,14
  Top 0.61: 3.95,14 R1.1
N$27
  Top 0.305: U2.P$24 23.4,10.45 | 23.4,9.3 C19.1
  Top 0.61: 23.4,10.45 23.4,9.3
  Top 1.016: C19.1 C17.1
N$28
  Top 0.61: Q1.3 45.05,11.15 R4.2
PDN
  Top 0.305: U2.P$25 29.7,10.65 29.75,10.35 25.85,5.05 P1.P$8
PSW
  Top 0.305: R2.2 46.75,8.55 43.95,5.4 P1.P$1
  Top 0.61: Q1.1 46.75,11.35 R2.2
RM
  pour Top (isolate 0.305): 45.8,49.2 55.3,49.2 55.3,38.5 45.8,38.6
RP
  pour Top (isolate 0.305): 42.6,49.2 42.6,38.6 34,38.6 33.8,49.2
RST
  Top 0.305: U2.P$32 32.6,14.2 34.7,11.9 36,11.9 36.95,11.15 37.15,11 37.15,8.55 38.7,6.75 39.7,6.75 41.35,5.05 P1.P$2
SCL
  Top 0.305: U2.P$30 32.7,13.2 33.95,11.85 34.5,11.2 35.7,11.2 36.2,10.85 R10.2 36.2,7.55 38.3,5.4 P1.P$3
SCLK  (via drill 0.4, 0.5)  (2 unrouted)
  Top 0.305: U2.P$27 31.8,11.7 32.2,11.2 32.2,10.3 30.9,7.3 P1.P$6
  Bottom 0.406: v16.5,2.4 29.9,2.3 v30.9,3.9
SDA
  Top 0.305: P1.P$4 35.7,5.6 R11.2 33.45,7.65 33.45,11.6 32.45,12.7 U2.P$29
SDIN
  Top 0.305: U2.P$28 32.15,12.2 32.85,11.4 32.85,6.95 33.35,6.35 P1.P$5
VDD
  Top 0.305: U2.P$4 21.85,20.7 21.5,20.55 20.2,20.45 C15.2 | U2.P$41 35.7,18.65 C31.2
  pour Top (isolate 0.305, rank 3): 0.15,14.9 60.9,14.55 60.95,37.4 0.3,37.5
VIN  (via drill 0.5, 0.6)  (1 unrouted)
  Top 0.254: 3.5,11.1 3.45,11.2
  Top 0.305: 4.4,10.9 5.07,10.23 U1.2 4.95,7.85 5.3,9.95 5.5,8.6 5.55,8.2 U1.3 | 5.5,7.95 v5.2,7.5
  Top 0.406: 5.5,8.6 5.5,7.95
  Top 0.61: 4.4,10.9 3.7,10.9 3.5,11.1 | 3.45,11.2 R1.2 | v5.2,7.5 5.3,9.95 | v41.6,9.05 41.2,9.1 R3.2
  Top 0.813: J1.1 1.9,11.6 R1.2
  Bottom 0.813: v5.2,7.5 5.15,2.3 5.8,0.9 50.7,0.9 J2.1
  other vias: 52.75,9.3 54.05,9.3 55.4,12.15 55.4,10.85 54.1,10.8 40.15,12.4 41.55,12.4 55.35,9.3 52.8,10.8 54.2,12.1 38.65,12.35 38.35,11.35 38.35,10.2 52.8,12.1 40.15,9.1 38.55,9.1
  pour Top: 37.95,8.7 42,8.7 42,12.75 38,12.75
  pour Top: 52.4,16.8 52.4,3.8 55.8,3.8 55.8,16.8
  pour Bottom (isolate 0.305): 37.95,8.75 55.95,8.75 55.95,12.6 38,12.65

### Text on the board
tPlace: + | + | + | +
tNames: LP | LM | RP | RM | VIN | 1 | 0 | VIN | 3V3 | GND | PDN | WS | BCK | DI | SDA | SCL | RST | PSW | - | + | MCLK
bNames: LP | LM | RP | RM | 3V3 | GND | PDN | WS | BCK | DI | SDA | SCL | RST | PSW | - | + | MCLK